# Altium schematic sheet ADCduinoModule_Sensor_1.SchDoc
size 594 x 420 mm; DocumentNumber: Введите номер платы + Э3; SheetNumber: номер страницы; Format: A2
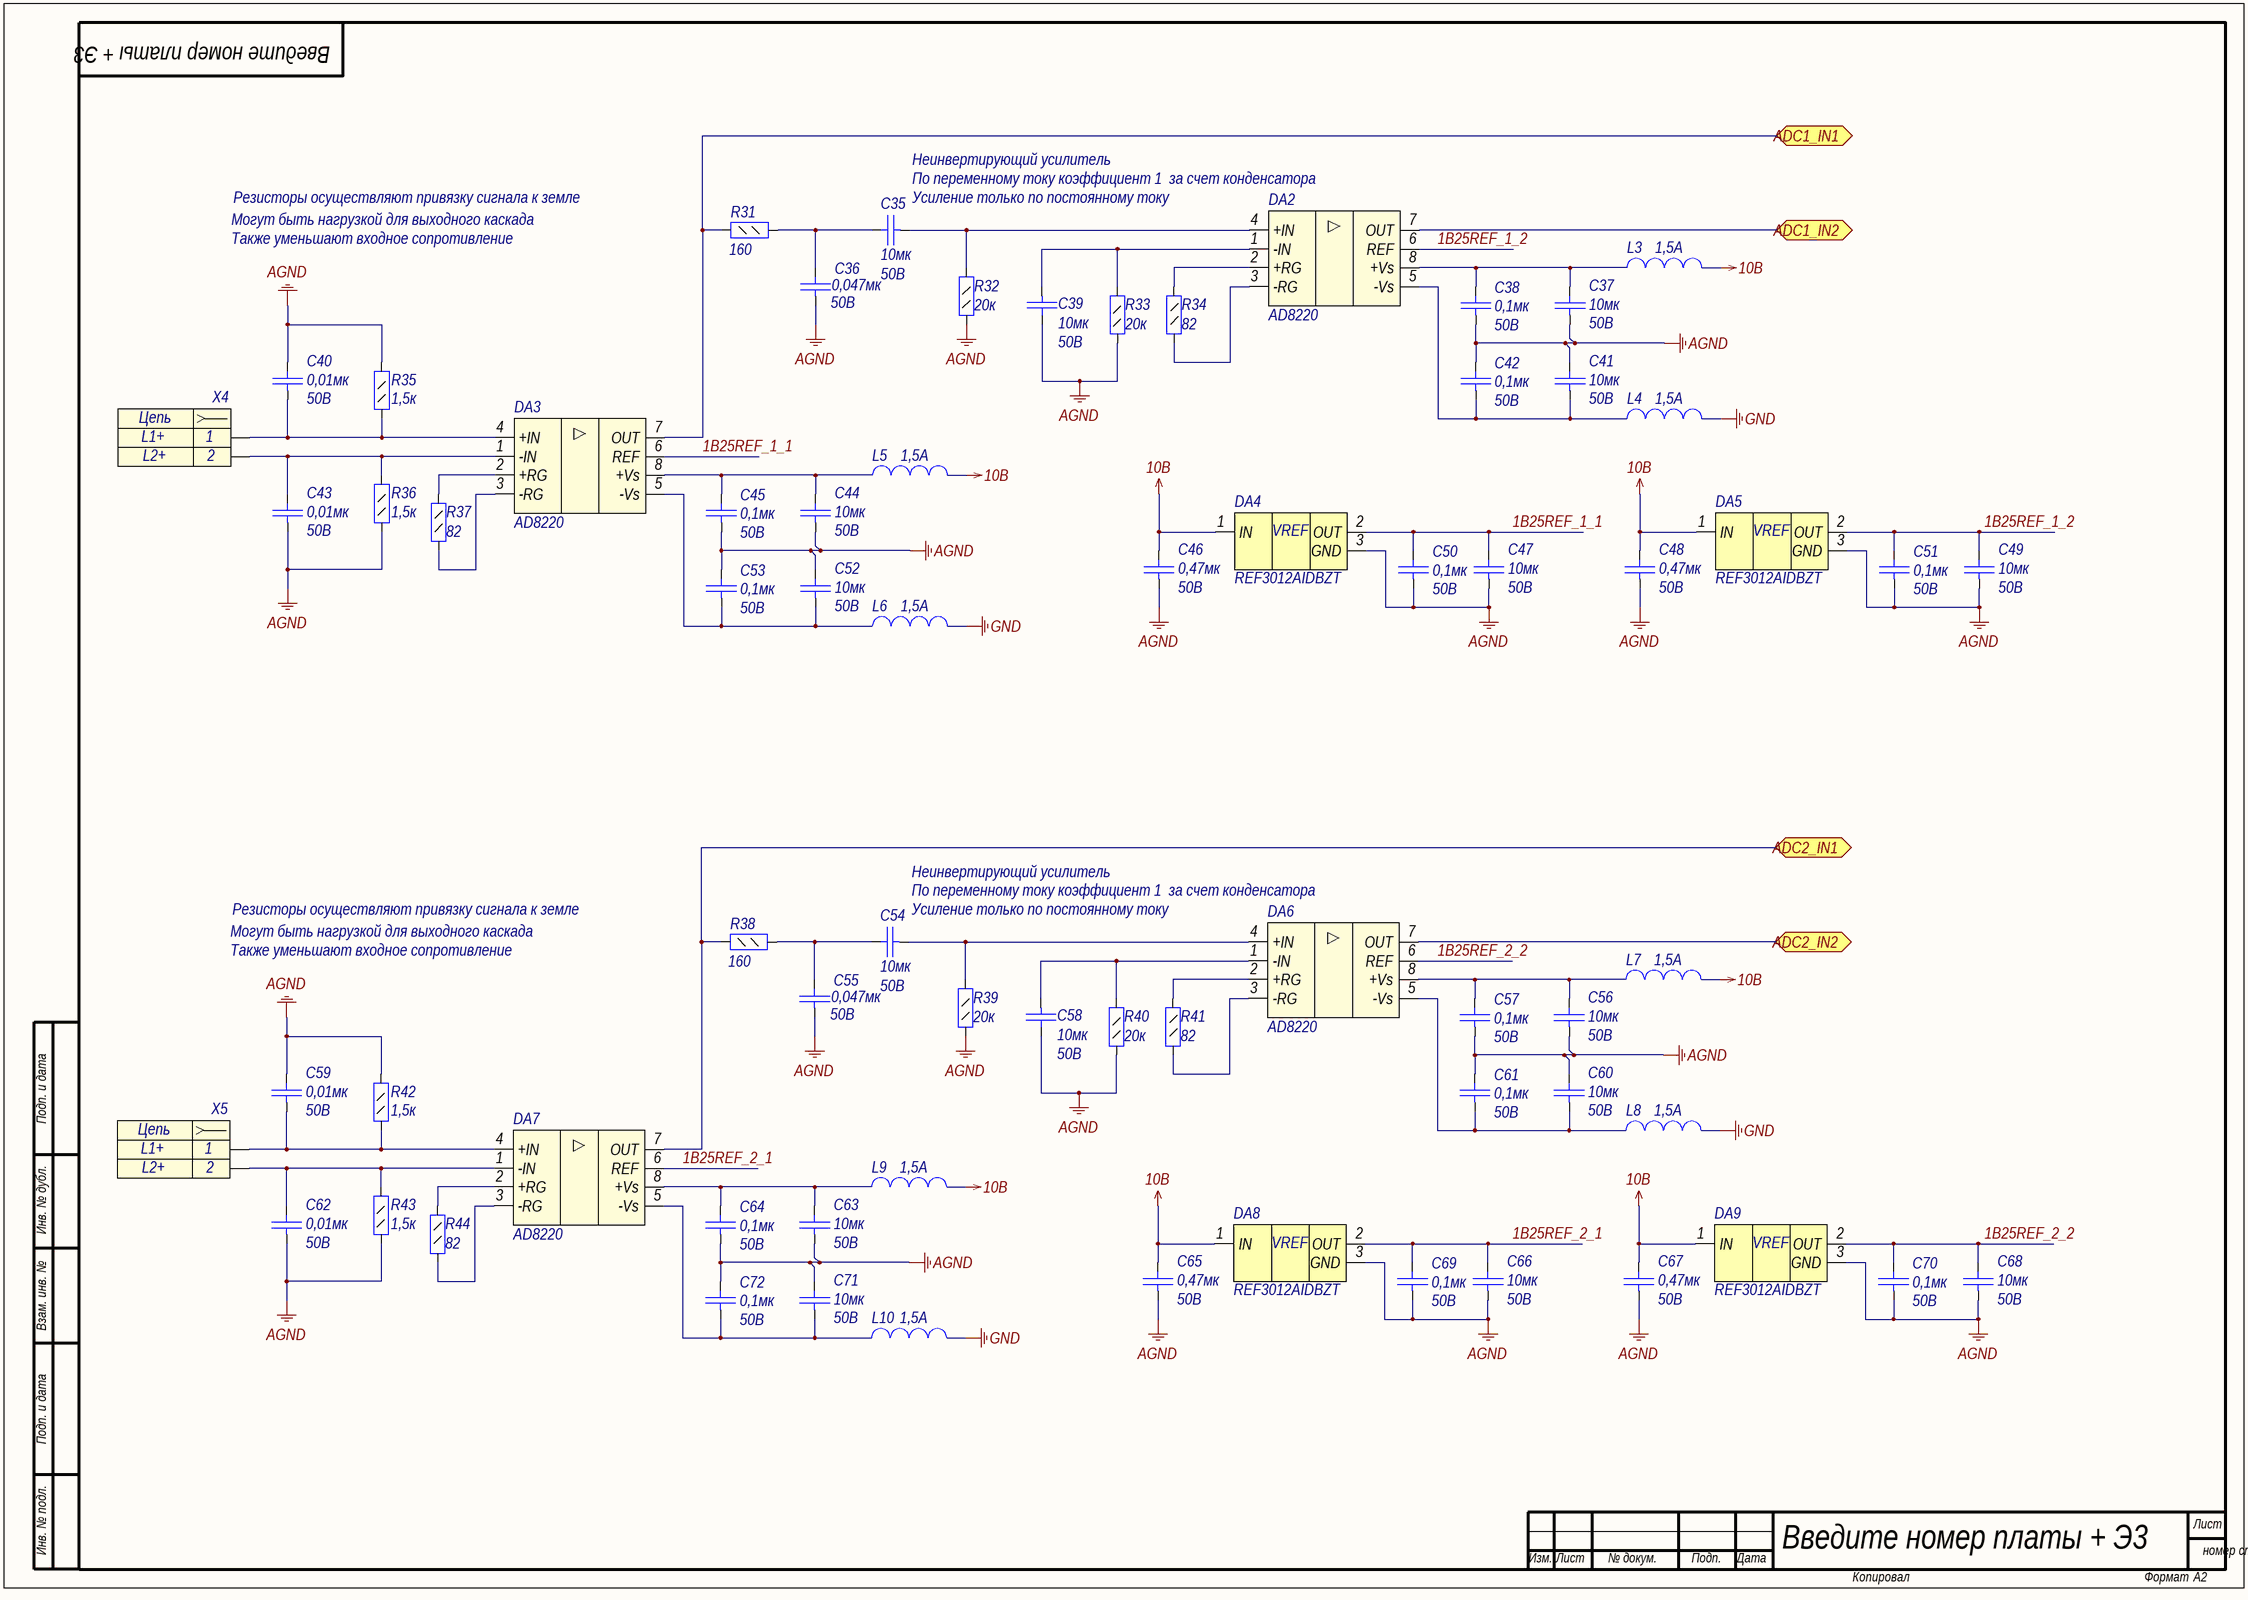
[diagram p0: ADCduinoModule_Sensor_1.SchDoc]

## Parts
C35  value 10мк  Voltage: 50В  [C1210]  (hidden comment: Capacitor)
C36  value 0,047мк  Voltage: 50B  [C0805]  (hidden comment: Capacitor)
C37  value 10мк  Voltage: 50В  [C1210]  (hidden comment: Capacitor)
C38  value 0,1мк  Voltage: 50B  [C0805]  (hidden comment: Capacitor)
C39  value 10мк  Voltage: 50В  [C1210]  (hidden comment: Capacitor)
C40  value 0,01мк  Voltage: 50B  [C0805]  (hidden comment: Capacitor)
C41  value 10мк  Voltage: 50В  [C1210]  (hidden comment: Capacitor)
C42  value 0,1мк  Voltage: 50B  [C0805]  (hidden comment: Capacitor)
C43  value 0,01мк  Voltage: 50B  [C0805]  (hidden comment: Capacitor)
C44  value 10мк  Voltage: 50В  [C1210]  (hidden comment: Capacitor)
C45  value 0,1мк  Voltage: 50B  [C0805]  (hidden comment: Capacitor)
C46  value 0,47мк  Voltage: 50B  [C0805]  (hidden comment: Capacitor)
C47  value 10мк  Voltage: 50В  [C1210]  (hidden comment: Capacitor)
C48  value 0,47мк  Voltage: 50B  [C0805]  (hidden comment: Capacitor)
C49  value 10мк  Voltage: 50В  [C1210]  (hidden comment: Capacitor)
C50  value 0,1мк  Voltage: 50B  [C0805]  (hidden comment: Capacitor)
C51  value 0,1мк  Voltage: 50B  [C0805]  (hidden comment: Capacitor)
C52  value 10мк  Voltage: 50В  [C1210]  (hidden comment: Capacitor)
C53  value 0,1мк  Voltage: 50B  [C0805]  (hidden comment: Capacitor)
C54  value 10мк  Voltage: 50В  [C1210]  (hidden comment: Capacitor)
C55  value 0,047мк  Voltage: 50B  [C0805]  (hidden comment: Capacitor)
C56  value 10мк  Voltage: 50В  [C1210]  (hidden comment: Capacitor)
C57  value 0,1мк  Voltage: 50B  [C0805]  (hidden comment: Capacitor)
C58  value 10мк  Voltage: 50В  [C1210]  (hidden comment: Capacitor)
C59  value 0,01мк  Voltage: 50B  [C0805]  (hidden comment: Capacitor)
C60  value 10мк  Voltage: 50В  [C1210]  (hidden comment: Capacitor)
C61  value 0,1мк  Voltage: 50B  [C0805]  (hidden comment: Capacitor)
C62  value 0,01мк  Voltage: 50B  [C0805]  (hidden comment: Capacitor)
C63  value 10мк  Voltage: 50В  [C1210]  (hidden comment: Capacitor)
C64  value 0,1мк  Voltage: 50B  [C0805]  (hidden comment: Capacitor)
C65  value 0,47мк  Voltage: 50B  [C0805]  (hidden comment: Capacitor)
C66  value 10мк  Voltage: 50В  [C1210]  (hidden comment: Capacitor)
C67  value 0,47мк  Voltage: 50B  [C0805]  (hidden comment: Capacitor)
C68  value 10мк  Voltage: 50В  [C1210]  (hidden comment: Capacitor)
C69  value 0,1мк  Voltage: 50B  [C0805]  (hidden comment: Capacitor)
C70  value 0,1мк  Voltage: 50B  [C0805]  (hidden comment: Capacitor)
C71  value 10мк  Voltage: 50В  [C1210]  (hidden comment: Capacitor)
C72  value 0,1мк  Voltage: 50B  [C0805]  (hidden comment: Capacitor)
DA2  AD8220  [MSOP8]
DA3  AD8220  [MSOP8]
DA4  Part Number: REF3012AIDBZT  [SOT23-3]  (hidden comment: REF30xx)
DA5  Part Number: REF3012AIDBZT  [SOT23-3]  (hidden comment: REF30xx)
DA6  AD8220  [MSOP8]
DA7  AD8220  [MSOP8]
DA8  Part Number: REF3012AIDBZT  [SOT23-3]  (hidden comment: REF30xx)
DA9  Part Number: REF3012AIDBZT  [SOT23-3]  (hidden comment: REF30xx)
L3  Rated Current: 1,5A  [L0603]  (hidden comment: Inductor)
L4  Rated Current: 1,5A  [L0603]  (hidden comment: Inductor)
L5  Rated Current: 1,5A  [L0603]  (hidden comment: Inductor)
L6  Rated Current: 1,5A  [L0603]  (hidden comment: Inductor)
L7  Rated Current: 1,5A  [L0603]  (hidden comment: Inductor)
L8  Rated Current: 1,5A  [L0603]  (hidden comment: Inductor)
L9  Rated Current: 1,5A  [L0603]  (hidden comment: Inductor)
L10  Rated Current: 1,5A  [L0603]  (hidden comment: Inductor)
R31  value 160  [R0805]  (hidden comment: Resistor_0,125Вт)
R32  value 20к  [R0805]  (hidden comment: Resistor_0,125Вт)
R33  value 20к  [R0805]  (hidden comment: Resistor_0,125Вт)
R34  value 82  [R0805]  (hidden comment: Resistor_0,125Вт)
R35  value 1,5к  [R0805]  (hidden comment: Resistor_0,125Вт)
R36  value 1,5к  [R0805]  (hidden comment: Resistor_0,125Вт)
R37  value 82  [R0805]  (hidden comment: Resistor_0,125Вт)
R38  value 160  [R0805]  (hidden comment: Resistor_0,125Вт)
R39  value 20к  [R0805]  (hidden comment: Resistor_0,125Вт)
R40  value 20к  [R0805]  (hidden comment: Resistor_0,125Вт)
R41  value 82  [R0805]  (hidden comment: Resistor_0,125Вт)
R42  value 1,5к  [R0805]  (hidden comment: Resistor_0,125Вт)
R43  value 1,5к  [R0805]  (hidden comment: Resistor_0,125Вт)
R44  value 82  [R0805]  (hidden comment: Resistor_0,125Вт)
X4  Header_2_sct  [TAB_2PAD]  (value not drawn)
X5  Header_2_sct  [TAB_2PAD]  (value not drawn)

## Ports
ADC1_IN1, ADC1_IN2, ADC2_IN1, ADC2_IN2

## Nets
10B: C46.2 C48.2 C65.2 C67.2 DA4.1(IN) DA5.1(IN) DA8.1(IN) DA9.1(IN) L3.2 L5.2 L7.2 L9.2
AGND: C36.1 C37.1 C38.1 C39.2 C40.2 C41.2 C42.2 C43.1 C44.1 C45.1 C46.1 C47.1 C48.1 C49.1 C50.1 C51.1 C52.2 C53.2 C55.1 C56.1 C57.1 C58.2 C59.2 C60.2 C61.2 C62.1 C63.1 C64.1 C65.1 C66.1 C67.1 C68.1 C69.1 C70.1 C71.2 C72.2 DA4.3(GND) DA5.3(GND) DA8.3(GND) DA9.3(GND) R32.1 R33.1 R35.2 R36.1 R39.1 R40.1 R42.2 R43.1
GND: L4.2 L6.2 L8.2 L10.2
1B25REF_1_1: C47.2 C50.2 DA3.6(REF) DA4.2(OUT)
1B25REF_1_2: C49.2 C51.2 DA2.6(REF) DA5.2(OUT)
1B25REF_2_1: C66.2 C69.2 DA7.6(REF) DA8.2(OUT)
1B25REF_2_2: C68.2 C70.2 DA6.6(REF) DA9.2(OUT)
ADC1_IN1: DA3.7(OUT) R31.1 ; port ADC1_IN1
ADC1_IN2: DA2.7(OUT) ; port ADC1_IN2
ADC2_IN1: DA7.7(OUT) R38.1 ; port ADC2_IN1
ADC2_IN2: DA6.7(OUT) ; port ADC2_IN2
NetC35_1: C35.1 DA2.4(+IN) R32.2
NetC35_2: C35.2 C36.2 R31.2
NetC37_2: C37.2 C38.2 DA2.8(+Vs) L3.1
NetC39_1: C39.1 DA2.1(-IN) R33.2
NetC40_1: C40.1 DA3.4(+IN) R35.1 X4.1
NetC41_1: C41.1 C42.1 DA2.5(-Vs) L4.1
NetC43_2: C43.2 DA3.1(-IN) R36.2 X4.2
NetC44_2: C44.2 C45.2 DA3.8(+Vs) L5.1
NetC52_1: C52.1 C53.1 DA3.5(-Vs) L6.1
NetC54_1: C54.1 DA6.4(+IN) R39.2
NetC54_2: C54.2 C55.2 R38.2
NetC56_2: C56.2 C57.2 DA6.8(+Vs) L7.1
NetC58_1: C58.1 DA6.1(-IN) R40.2
NetC59_1: C59.1 DA7.4(+IN) R42.1 X5.1
NetC60_1: C60.1 C61.1 DA6.5(-Vs) L8.1
NetC62_2: C62.2 DA7.1(-IN) R43.2 X5.2
NetC63_2: C63.2 C64.2 DA7.8(+Vs) L9.1
NetC71_1: C71.1 C72.1 DA7.5(-Vs) L10.1
NetDA2_2: DA2.2(+RG) R34.1
NetDA2_3: DA2.3(-RG) R34.2
NetDA3_2: DA3.2(+RG) R37.1
NetDA3_3: DA3.3(-RG) R37.2
NetDA6_2: DA6.2(+RG) R41.1
NetDA6_3: DA6.3(-RG) R41.2
NetDA7_2: DA7.2(+RG) R44.1
NetDA7_3: DA7.3(-RG) R44.2

## Notes on the sheet
- Неинвертирующий усилитель
- Резисторы осуществляют привязку сигнала к земле
- По переменному току коэффициент 1  за счет конденсатора
- (near C35) Усиление только по постоянному току
- Могут быть нагрузкой для выходного каскада
- Также уменьшают входное сопротивление
- (near C54) Усиление только по постоянному току
- Подп. и дата
- Инв. № дубл.
- Взам. инв. №
- Инв. № подл.
- Лист
- Изм.
- № докум.
- Подп.
- Дата
- Копировал
- Формат
- (in symbol connect57) Цепь
- (in symbol REF3012AIDBZT) VREF

## Library data of the parts
C35 C37 C39 C41 C44 C47 C49 C52 C54 C56 C58 C60 C63 C66 C68 C71 = cap205: Конденсатор; Part Name: Ceramic; Manufacture: Murata; Part Number: GRM32ER71H106K; id: cap205; TKE: X7R
C36 C55 = cap140: Конденсатор; Part Name: Ceramic; Manufacture: Murata; Part Number: GRM21BR71H473K; id: cap140; TKE: X7R
C38 C42 C45 C50 C51 C53 C57 C61 C64 C69 C70 C72 = cap141: Конденсатор; Part Name: Ceramic; Manufacture: Murata; Part Number: GRM21BR71H104K**; id: cap141; TKE: X7R
C40 C43 C59 C62 = cap136: Конденсатор; Part Name: Ceramic; Manufacture: Murata; Part Number: GRM216R71H103K; id: cap136; TKE: X7R
C46 C48 C65 C67 = cap148: Конденсатор; Part Name: Ceramic; Manufacture: Murata; Part Number: GRM219R71C474K; id: cap148; TKE: X7R
DA2 DA3 DA6 DA7 = amp15: JFET Input Instrumentation Amplifier; Part Number: AD8220ARMZ; Manufacture: Analog Devices; id: amp15; Rail-to-rail: yes; Supply Voltage: 4,5В–36В or (+-)2,25В-(+-)18B; Supply Current max: 750uA; Bandwidth: 1,5MHz; Input Bias Current: 25pA; CMRR: 95dB; PSRR: 100dB; Offset voltage: (+-)0,125uB; Channels: 1; Part Name: JFET Input Instrumentation Amplifier
DA4 DA5 DA8 DA9 = REF3012AIDBZT: CMOS Voltage Reference; Manufacturer: Texas Instruments; id: ref2; Voltage min stabilize: 1,25B; Max input voltage: 5,5B; Accuracy: 0,002; Output current: 25mA; Part Name: CMOS Voltage Reference
L3-L10 = ind0: EMI Suppression Filter; Part Name: EMI Suppression Filters; Part Number: BLM18PG181SN1D; id: ind0; Resistance: 0,09Ohm
R31 R38 = res54: Резистор; Manufacture: Yageo; Part Number: RC0805FR-07160RL; id: res54; Accuracy: 0,01; Part Name: Resistor; Power: 0,125Вт
R32 R33 R39 R40 = res104: Резистор; Manufacture: Yageo; Part Number: RC0805FR-0720KL; id: res104; Accuracy: 0,01; Part Name: Resistor; Power: 0,125Вт
R34 R37 R41 R44 = res47: Резистор; Manufacture: Yageo; Part Number: RC0805FR-0782RL; id: res47; Accuracy: 0,01; Part Name: Resistor; Power: 0,125Вт
R35 R36 R42 R43 = res77: Резистор; Manufacture: Yageo; Part Number: RC0805FR-071K5; id: res77; Accuracy: 0,01; Part Name: Resistor; Power: 0,125Вт
X4 X5 = connect57: Разъем - 2 конт. розетка; Part Name: Place for wires; Contact_1: L1+; Contact_2: L2+; id: connect57